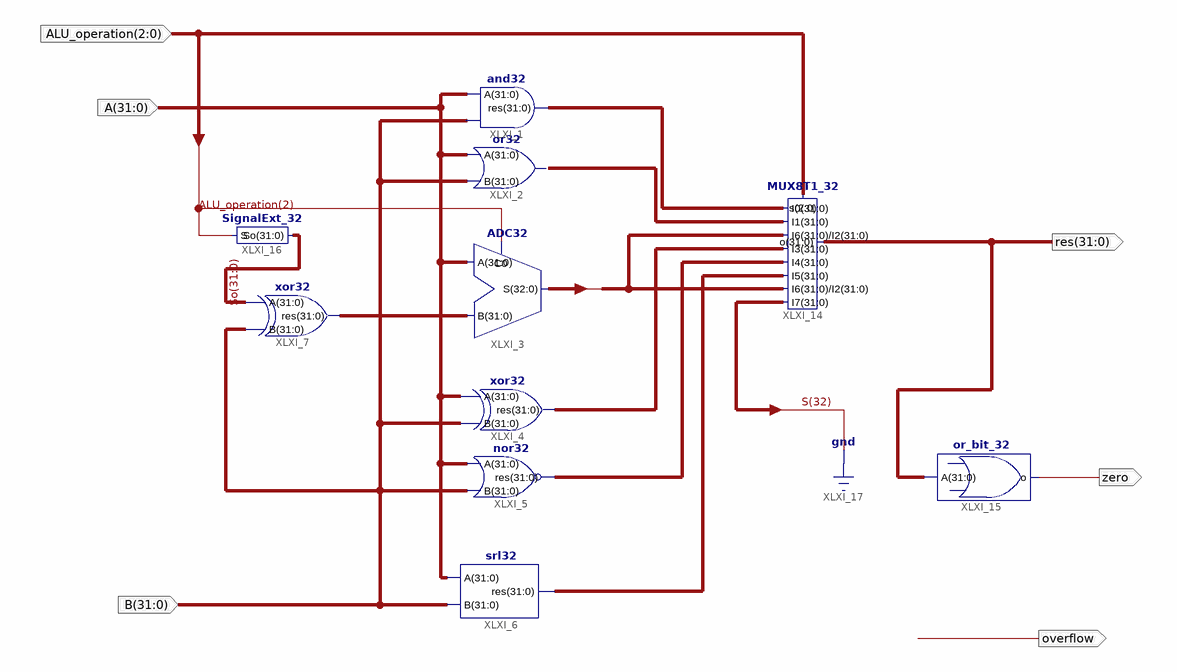
[diagram p0: schematic sheet 1]
// Xilinx ISE schematic alu1.sch (kintex7) as structural Verilog: 10 symbols, 6 ports
module alu1 (
  input  [31:0] B,
  input  [31:0] A,
  input  [2:0] ALU_operation,
  output [31:0] res,
  output zero,
  output overflow
);

  wire N0;
  wire [31:0] So, XLXN_2, XLXN_17, XLXN_18, XLXN_20, XLXN_21, XLXN_22;
  wire [32:0] S;

  xor32 XLXI_7 (.A(So), .B(B), .res(XLXN_2));
  and32 XLXI_1 (.res(XLXN_17), .A(A), .B(B));
  or32 XLXI_2 (.A(A), .B(B));  // open: res
  ADC32 XLXI_3 (.B(XLXN_2), .A(A), .C0(ALU_operation[2]), .S(S));
  xor32 XLXI_4 (.A(A), .B(B), .res(XLXN_20));
  nor32 XLXI_5 (.res(XLXN_21), .A(A), .B(B));
  srl32 XLXI_6 (.A(A), .B(B), .res(XLXN_22));
  MUX8T1_32 XLXI_14 (
    .s(ALU_operation), .I7({{31{N0}}, S[32]}), .I6(S[31:0]), .I5(XLXN_22), .I4(XLXN_21), .I3(XLXN_20),
    .I2(S[31:0]), .I1(XLXN_18), .I0(XLXN_17), .o(res));
  or_bit_32 XLXI_15 (.o(zero), .A(res));
  SignalExt_32 XLXI_16 (.So(So), .S(ALU_operation[2]));
  // also tied to GND on the sheet: S[32]
endmodule
